# Altium schematic sheet PowerClocks.SCHDOC
size B
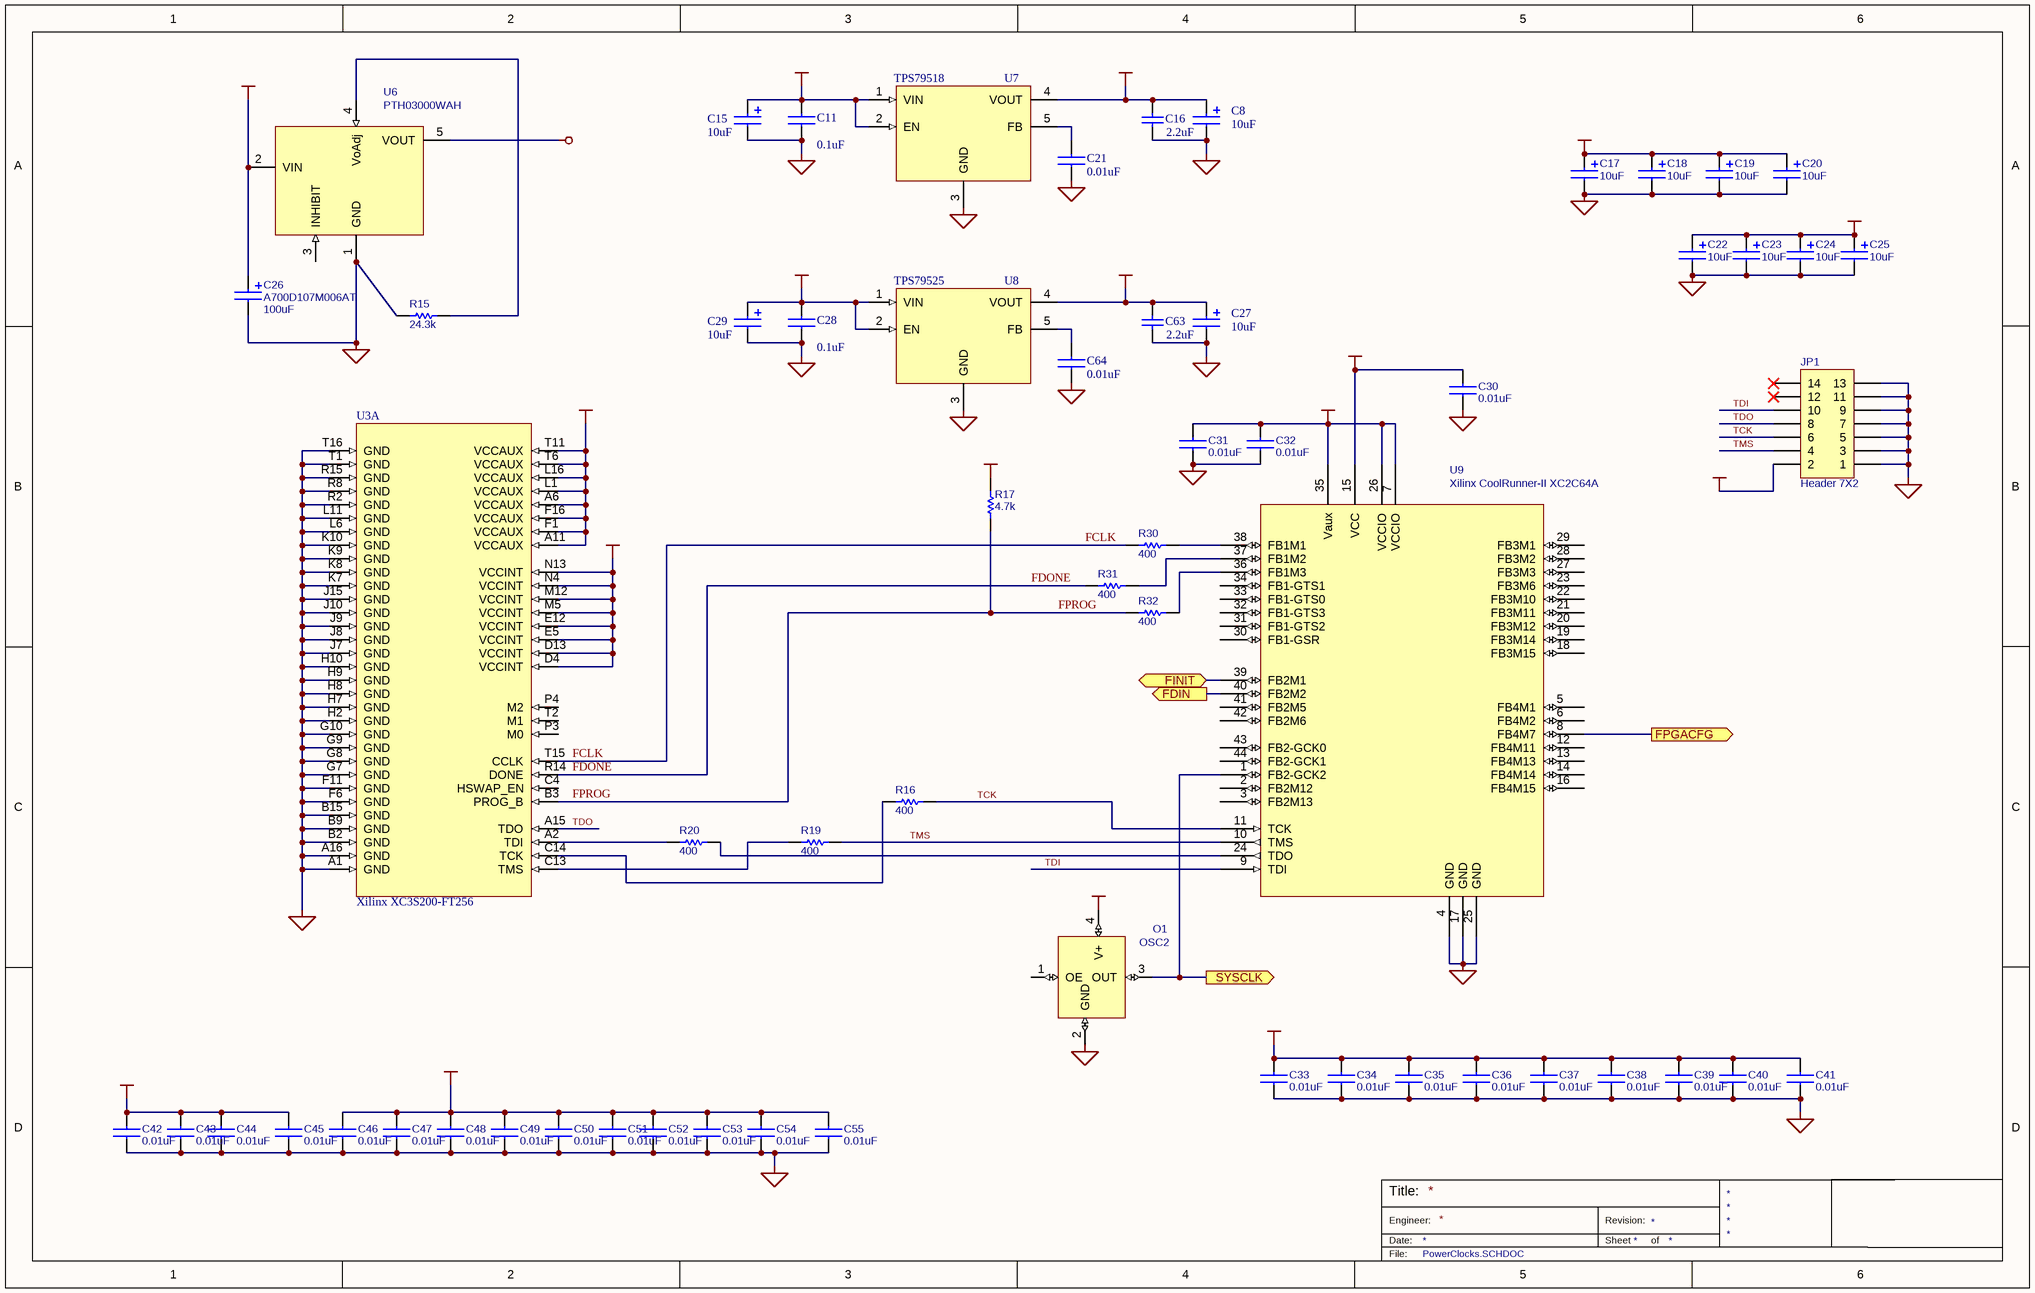
[diagram p0: PowerClocks.SCHDOC]

## Parts
C8  value 10uF  [3216]  (hidden comment: POLCAP)
C11  value 0.1uF  [0603]  (hidden comment: CAPACITOR)
C15  value 10uF  [3216]  (hidden comment: POLCAP)
C16  value 2.2uF  [1206]  (hidden comment: Cap)
C17  value 10uF  [3216]  (hidden comment: Bypass Cap)
C18  value 10uF  [3216]  (hidden comment: Bypass Cap)
C19  value 10uF  [3216]  (hidden comment: Bypass Cap)
C20  value 10uF  [3216]  (hidden comment: Bypass Cap)
C21  value 0.01uF  [0402]  (hidden comment: CAPACITOR)
C22  value 10uF  [3216]  (hidden comment: Bypass Cap)
C23  value 10uF  [3216]  (hidden comment: Bypass Cap)
C24  value 10uF  [3216]  (hidden comment: Bypass Cap)
C25  value 10uF  [3216]  (hidden comment: Bypass Cap)
C26  A700D107M006AT  value 100uF  [7343]
C27  value 10uF  [3216]  (hidden comment: POLCAP)
C28  value 0.1uF  [0603]  (hidden comment: CAPACITOR)
C29  value 10uF  [3216]  (hidden comment: POLCAP)
C30  value 0.01uF  [0402]  (hidden comment: CAPACITOR)
C31  value 0.01uF  [0402]  (hidden comment: CAPACITOR)
C32  value 0.01uF  [0402]  (hidden comment: CAPACITOR)
C33  value 0.01uF  [0402]  (hidden comment: CAPACITOR)
C34  value 0.01uF  [0402]  (hidden comment: CAPACITOR)
C35  value 0.01uF  [0402]  (hidden comment: CAPACITOR)
C36  value 0.01uF  [0402]  (hidden comment: CAPACITOR)
C37  value 0.01uF  [0402]  (hidden comment: CAPACITOR)
C38  value 0.01uF  [0402]  (hidden comment: CAPACITOR)
C39  value 0.01uF  [0402]  (hidden comment: CAPACITOR)
C40  value 0.01uF  [0402]  (hidden comment: CAPACITOR)
C41  value 0.01uF  [0402]  (hidden comment: CAPACITOR)
C42  value 0.01uF  [0402]  (hidden comment: CAPACITOR)
C43  value 0.01uF  [0402]  (hidden comment: CAPACITOR)
C44  value 0.01uF  [0402]  (hidden comment: CAPACITOR)
C45  value 0.01uF  [0402]  (hidden comment: CAPACITOR)
C46  value 0.01uF  [0402]  (hidden comment: CAPACITOR)
C47  value 0.01uF  [0402]  (hidden comment: CAPACITOR)
C48  value 0.01uF  [0402]  (hidden comment: CAPACITOR)
C49  value 0.01uF  [0402]  (hidden comment: CAPACITOR)
C50  value 0.01uF  [0402]  (hidden comment: CAPACITOR)
C51  value 0.01uF  [0402]  (hidden comment: CAPACITOR)
C52  value 0.01uF  [0402]  (hidden comment: CAPACITOR)
C53  value 0.01uF  [0402]  (hidden comment: CAPACITOR)
C54  value 0.01uF  [0402]  (hidden comment: CAPACITOR)
C55  value 0.01uF  [0402]  (hidden comment: CAPACITOR)
C63  value 2.2uF  [1206]  (hidden comment: Cap)
C64  value 0.01uF  [0402]  (hidden comment: CAPACITOR)
JP1  Header 7X2  [SMT 2x7 2mm HDR]
O1  OSC2  [ECS-3953M]
R15  value 24.3k  [1206]  (hidden comment: RESISTOR)
R16  value 400  [0603]  (hidden comment: current-limiting series res)
R17  value 4.7k  [0603]  (hidden comment: RESISTOR)
R19  value 400  [0603]  (hidden comment: current-limiting series res)
R20  value 400  [0603]  (hidden comment: current-limiting series res)
R30  value 400  [0603]  (hidden comment: current-limiting series res)
R31  value 400  [0603]  (hidden comment: current-limiting series res)
R32  value 400  [0603]  (hidden comment: current-limiting series res)
U3  Xilinx XC3S200-FT256  [Xilinx FT256 BGA]  (part A of 9)
U6  PTH03000WAH  [TI EUS]
U7  TPS79518  [SOT223-5/Simple]
U8  TPS79525  [SOT223-5/Simple]
U9  Xilinx CoolRunner-II XC2C64A  [QFP10x10-G44/G10N]

## Ports
FDIN (out), FINIT (bidir), FPGACFG (out), SYSCLK (out)

## Nets
+1.2VCC: C22.1 C23.1 C24.1 C25.1 C42.2 C43.2 C44.2 C45.2 U3.D4(VCCINT) U3.D13(VCCINT) U3.E5(VCCINT) U3.E12(VCCINT) U3.M5(VCCINT) U3.M12(VCCINT) U3.N4(VCCINT) U3.N13(VCCINT) U6.5(VOUT)
+1.8VCC: C8.1 C16.2 C30.2 U7.4(VOUT) U9.15(VCC)
+2.5VCC: C27.1 C46.2 C47.2 C48.2 C49.2 C50.2 C51.2 C52.2 C53.2 C54.2 C55.2 C63.2 R17.1 U3.A6(VCCAUX) U3.A11(VCCAUX) U3.F1(VCCAUX) U3.F16(VCCAUX) U3.L1(VCCAUX) U3.L16(VCCAUX) U3.T6(VCCAUX) U3.T11(VCCAUX) U8.4(VOUT)
GND: C8.2 C11.1 C15.2 C16.1 C17.2 C18.2 C19.2 C20.2 C21.1 C22.2 C23.2 C24.2 C25.2 C26.2 C27.2 C28.1 C29.2 C30.1 C31.1 C32.1 C33.1 C34.1 C35.1 C36.1 C37.1 C38.1 C39.1 C40.1 C41.1 C42.1 C43.1 C44.1 C45.1 C46.1 C47.1 C48.1 C49.1 C50.1 C51.1 C52.1 C53.1 C54.1 C55.1 C63.1 C64.1 JP1.1 JP1.3 JP1.5 JP1.7 JP1.9 JP1.11 JP1.13 O1.2(GND) R15.2 U3.A1(GND) U3.A16(GND) U3.B2(GND) U3.B9(GND) U3.B15(GND) U3.F6(GND) U3.F11(GND) U3.G7(GND) U3.G8(GND) U3.G9(GND) U3.G10(GND) U3.H2(GND) U3.H7(GND) U3.H8(GND) U3.H9(GND) U3.H10(GND) U3.J7(GND) U3.J8(GND) U3.J9(GND) U3.J10(GND) U3.J15(GND) U3.K7(GND) U3.K8(GND) U3.K9(GND) U3.K10(GND) U3.L6(GND) U3.L11(GND) U3.R2(GND) U3.R8(GND) U3.R15(GND) U3.T1(GND) U3.T16(GND) U6.1(GND) U7.3(GND) U8.3(GND) U9.4(GND) U9.17(GND) U9.25(GND)
VCC: C11.2 C15.1 C17.1 C18.1 C19.1 C20.1 C26.1 C28.2 C29.1 C31.2 C32.2 C33.2 C34.2 C35.2 C36.2 C37.2 C38.2 C39.2 C40.2 C41.2 JP1.2 O1.4(V+) U6.2(VIN) U7.1(VIN) U7.2(EN) U8.1(VIN) U8.2(EN) U9.7(VCCIO) U9.26(VCCIO) U9.35(Vaux)
FCLK: R30.2 U3.T15(CCLK)
FDIN: U9.40(FB2M2) ; port FDIN
FDONE: R31.2 U3.R14(DONE)
FINIT: U9.39(FB2M1) ; port FINIT
FPGACFG: U9.8(FB4M7) ; port FPGACFG
FPROG: R17.2 R32.2 U3.B3(PROG_B)
SYSCLK: O1.3(OUT) U9.1(FB2-GCK2) ; port SYSCLK
TCK: JP1.6 R16.1 U9.11(TCK)
TDI: JP1.10 U9.9(TDI)
TDO: JP1.8 U3.A15(TDO)
TMS: JP1.4 R19.2 U9.10(TMS)
NetC21_2: C21.2 U7.5(FB)
NetC64_2: C64.2 U8.5(FB)
NetR15_1: R15.1 U6.4(VoAdj)
NetR16_2: R16.2 U3.C14(TCK)
NetR19_1: R19.1 U3.C13(TMS)
NetR20_1: R20.1 U9.24(TDO)
NetR20_2: R20.2 U3.A2(TDI)
NetR30_1: R30.1 U9.38(FB1M1)
NetR31_1: R31.1 U9.37(FB1M2)
NetR32_1: R32.1 U9.36(FB1M3)

Not connected (* = marked no-connect by the designer): JP1 12* 14*; O1 1(OE); U3 C4(HSWAP_EN) P3(M0) P4(M2) T2(M1); U6 3(INHIBIT); U9 2(FB2M12) 3(FB2M13) 5(FB4M1) 6(FB4M2) 12(FB4M11) 13(FB4M13) 14(FB4M14) 16(FB4M15) 18(FB3M15) 19(FB3M14) 20(FB3M12) 21(FB3M11) 22(FB3M10) 23(FB3M6) 27(FB3M3) 28(FB3M2) 29(FB3M1) 30(FB1-GSR) 31(FB1-GTS2) 32(FB1-GTS3) 33(FB1-GTS0) 34(FB1-GTS1) 41(FB2M5) 42(FB2M6) 43(FB2-GCK0) 44(FB2-GCK1)

## Notes on the sheet
- Title:
- Engineer:
- Date:
- Revision:
- Sheet
- of
- File:

## Library data of the parts
C8 C15 C17-C20 C22-C25 C27 C29 = POLCAP: Standard Capacitor; Voltage: 10V
C11 C21 C28 C30-C55 C64 = CAPACITOR: Standard Capacitor
C16 C63 = Cap: Capacitor; Manufacturer: Generic Components; Class I: Passive; Published: 8-Jun-2000; Revision: July-2002: Re-released for DXP Platform.; Publisher: Altium Limited; Class II: Capacitor
C26 = POLCAP: Standard Capacitor
JP1 = Header 7X2: Header, 7-Pin, Dual row; Manufacturer: Generic Components; Class I: Connector; Vendor: MOLEX 87831-1420; Revision: July-2002: Re-released for DXP Platform.; Publisher: Altium Limited
O1 = OSC2: ECS SMD Oscillator, ECS-3953M
R15 R16 R19 R20 R30-R32 = RESISTOR: Standard Passive Resistor
R17 = RESISTOR: Standard Passive Resistor; Tolerance: 1%
U3 = XC3S200-FT256: Xilinx Spartan-3 FPGA
U6 = PTH03000: TI POL converter, through-hole
U7 U8 = TPS795XX: TI Ultra-low-noise LDO
U9 = XC2C64A-5VQ44C